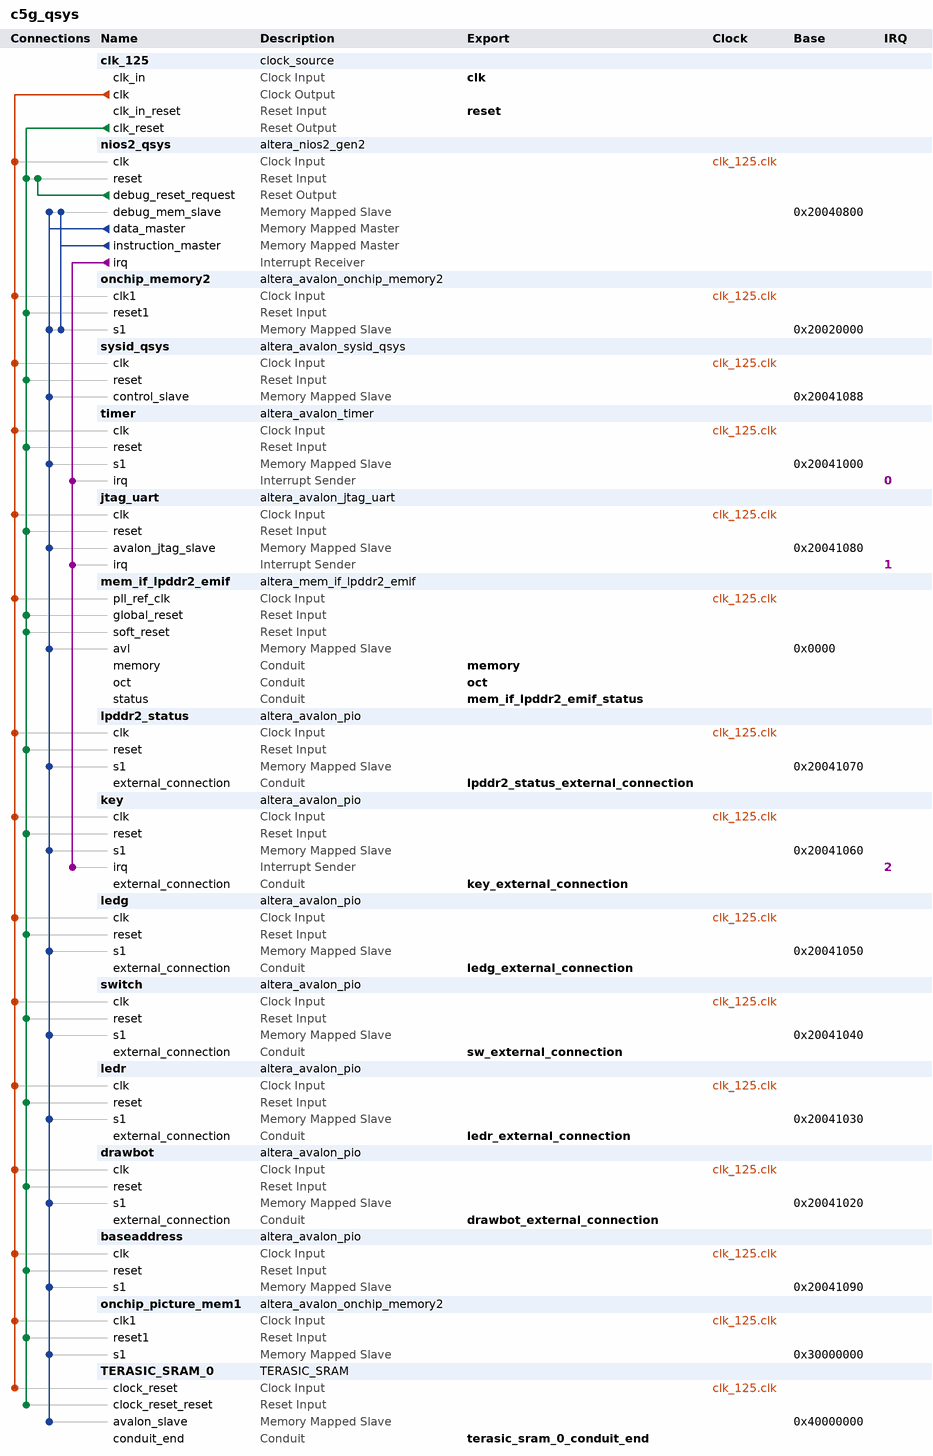
[diagram p0: system contents]
# Platform Designer (Qsys) system c5g_qsys, Cyclone V 5CGXFC5C6F27C7
# Parameters at their usual value, and those the tool derives, are not listed.
package require -exact qsys 15.1
create_system c5g_qsys
set_project_property DEVICE_FAMILY {Cyclone V}
set_project_property DEVICE 5CGXFC5C6F27C7

add_instance clk_125 clock_source 15.1
set_instance_parameter_value clk_125 clockFrequency 125000000

add_instance nios2_qsys altera_nios2_gen2 15.1
set_instance_parameter_value nios2_qsys dcache_size 2048
set_instance_parameter_value nios2_qsys exceptionSlave onchip_memory2.s1
set_instance_parameter_value nios2_qsys icache_size 4096
set_instance_parameter_value nios2_qsys impl Fast
set_instance_parameter_value nios2_qsys resetSlave onchip_memory2.s1
set_instance_parameter_value nios2_qsys setting_activateTrace true

add_instance onchip_memory2 altera_avalon_onchip_memory2 15.1
set_instance_parameter_value onchip_memory2 dataWidth 32
set_instance_parameter_value onchip_memory2 dualPort false
set_instance_parameter_value onchip_memory2 initMemContent true
set_instance_parameter_value onchip_memory2 initializationFileName onchip_mem.hex
set_instance_parameter_value onchip_memory2 memorySize 128000

add_instance sysid_qsys altera_avalon_sysid_qsys 15.1
set_instance_parameter_value sysid_qsys id -1091581186

add_instance timer altera_avalon_timer 15.1
set_instance_parameter_value timer period 1
set_instance_parameter_value timer periodUnits USEC

add_instance jtag_uart altera_avalon_jtag_uart 15.1
set_instance_parameter_value jtag_uart simInteractiveOptions NO_INTERACTIVE_WINDOWS

add_instance mem_if_lpddr2_emif altera_mem_if_lpddr2_emif 15.1
set_instance_parameter_value mem_if_lpddr2_emif ABSTRACT_REAL_COMPARE_TEST false
set_instance_parameter_value mem_if_lpddr2_emif ABS_RAM_MEM_INIT_FILENAME meminit
set_instance_parameter_value mem_if_lpddr2_emif ACV_PHY_CLK_ADD_FR_PHASE 0.0
set_instance_parameter_value mem_if_lpddr2_emif AC_PACKAGE_DESKEW false
set_instance_parameter_value mem_if_lpddr2_emif AC_ROM_USER_ADD_0 0_0000_0000_0000
set_instance_parameter_value mem_if_lpddr2_emif AC_ROM_USER_ADD_1 0_0000_0000_1000
set_instance_parameter_value mem_if_lpddr2_emif ADDR_ORDER 0
set_instance_parameter_value mem_if_lpddr2_emif ADD_EFFICIENCY_MONITOR false
set_instance_parameter_value mem_if_lpddr2_emif ADD_EXTERNAL_SEQ_DEBUG_NIOS false
set_instance_parameter_value mem_if_lpddr2_emif ADVANCED_CK_PHASES false
set_instance_parameter_value mem_if_lpddr2_emif ADVERTIZE_SEQUENCER_SW_BUILD_FILES false
set_instance_parameter_value mem_if_lpddr2_emif AFI_DEBUG_INFO_WIDTH 32
set_instance_parameter_value mem_if_lpddr2_emif ALTMEMPHY_COMPATIBLE_MODE false
set_instance_parameter_value mem_if_lpddr2_emif AP_MODE false
set_instance_parameter_value mem_if_lpddr2_emif AP_MODE_EN 0
set_instance_parameter_value mem_if_lpddr2_emif AVL_DATA_WIDTH_PORT 32,32,32,32,32,32
set_instance_parameter_value mem_if_lpddr2_emif AVL_MAX_SIZE 4
set_instance_parameter_value mem_if_lpddr2_emif BYTE_ENABLE true
set_instance_parameter_value mem_if_lpddr2_emif C2P_WRITE_CLOCK_ADD_PHASE 0.0
set_instance_parameter_value mem_if_lpddr2_emif CALIBRATION_MODE Skip
set_instance_parameter_value mem_if_lpddr2_emif CALIB_REG_WIDTH 8
set_instance_parameter_value mem_if_lpddr2_emif CFG_DATA_REORDERING_TYPE INTER_BANK
set_instance_parameter_value mem_if_lpddr2_emif CFG_REORDER_DATA true
set_instance_parameter_value mem_if_lpddr2_emif CFG_TCCD_NS 2.5
set_instance_parameter_value mem_if_lpddr2_emif COMMAND_PHASE 0.0
set_instance_parameter_value mem_if_lpddr2_emif CONTROLLER_LATENCY 5
set_instance_parameter_value mem_if_lpddr2_emif CORE_DEBUG_CONNECTION EXPORT
set_instance_parameter_value mem_if_lpddr2_emif CPORT_TYPE_PORT Bidirectional,Bidirectional,Bidirectional,Bidirectional,Bidirectional,Bidirectional
set_instance_parameter_value mem_if_lpddr2_emif CTL_AUTOPCH_EN false
set_instance_parameter_value mem_if_lpddr2_emif CTL_CMD_QUEUE_DEPTH 8
set_instance_parameter_value mem_if_lpddr2_emif CTL_CSR_CONNECTION INTERNAL_JTAG
set_instance_parameter_value mem_if_lpddr2_emif CTL_CSR_ENABLED false
set_instance_parameter_value mem_if_lpddr2_emif CTL_CSR_READ_ONLY 1
set_instance_parameter_value mem_if_lpddr2_emif CTL_DEEP_POWERDN_EN false
set_instance_parameter_value mem_if_lpddr2_emif CTL_DYNAMIC_BANK_ALLOCATION false
set_instance_parameter_value mem_if_lpddr2_emif CTL_DYNAMIC_BANK_NUM 4
set_instance_parameter_value mem_if_lpddr2_emif CTL_ECC_AUTO_CORRECTION_ENABLED false
set_instance_parameter_value mem_if_lpddr2_emif CTL_ECC_ENABLED false
set_instance_parameter_value mem_if_lpddr2_emif CTL_ENABLE_BURST_INTERRUPT false
set_instance_parameter_value mem_if_lpddr2_emif CTL_ENABLE_BURST_TERMINATE false
set_instance_parameter_value mem_if_lpddr2_emif CTL_HRB_ENABLED false
set_instance_parameter_value mem_if_lpddr2_emif CTL_LOOK_AHEAD_DEPTH 4
set_instance_parameter_value mem_if_lpddr2_emif CTL_SELF_REFRESH_EN false
set_instance_parameter_value mem_if_lpddr2_emif CTL_USR_REFRESH_EN false
set_instance_parameter_value mem_if_lpddr2_emif CTL_ZQCAL_EN false
set_instance_parameter_value mem_if_lpddr2_emif CUT_NEW_FAMILY_TIMING true
set_instance_parameter_value mem_if_lpddr2_emif DAT_DATA_WIDTH 32
set_instance_parameter_value mem_if_lpddr2_emif DEBUG_MODE false
set_instance_parameter_value mem_if_lpddr2_emif DEVICE_DEPTH 1
set_instance_parameter_value mem_if_lpddr2_emif DISABLE_CHILD_MESSAGING false
set_instance_parameter_value mem_if_lpddr2_emif DISCRETE_FLY_BY true
set_instance_parameter_value mem_if_lpddr2_emif DLL_SHARING_MODE None
set_instance_parameter_value mem_if_lpddr2_emif DQS_DQSN_MODE DIFFERENTIAL
set_instance_parameter_value mem_if_lpddr2_emif DQ_INPUT_REG_USE_CLKN false
set_instance_parameter_value mem_if_lpddr2_emif DUPLICATE_AC false
set_instance_parameter_value mem_if_lpddr2_emif ED_EXPORT_SEQ_DEBUG false
set_instance_parameter_value mem_if_lpddr2_emif ENABLE_ABS_RAM_MEM_INIT false
set_instance_parameter_value mem_if_lpddr2_emif ENABLE_BONDING false
set_instance_parameter_value mem_if_lpddr2_emif ENABLE_BURST_MERGE false
set_instance_parameter_value mem_if_lpddr2_emif ENABLE_CTRL_AVALON_INTERFACE true
set_instance_parameter_value mem_if_lpddr2_emif ENABLE_DELAY_CHAIN_WRITE false
set_instance_parameter_value mem_if_lpddr2_emif ENABLE_EMIT_BFM_MASTER false
set_instance_parameter_value mem_if_lpddr2_emif ENABLE_EXPORT_SEQ_DEBUG_BRIDGE false
set_instance_parameter_value mem_if_lpddr2_emif ENABLE_EXTRA_REPORTING false
set_instance_parameter_value mem_if_lpddr2_emif ENABLE_ISS_PROBES false
set_instance_parameter_value mem_if_lpddr2_emif ENABLE_NON_DESTRUCTIVE_CALIB false
set_instance_parameter_value mem_if_lpddr2_emif ENABLE_NON_DES_CAL false
set_instance_parameter_value mem_if_lpddr2_emif ENABLE_NON_DES_CAL_TEST false
set_instance_parameter_value mem_if_lpddr2_emif ENABLE_SEQUENCER_MARGINING_ON_BY_DEFAULT false
set_instance_parameter_value mem_if_lpddr2_emif ENABLE_USER_ECC false
set_instance_parameter_value mem_if_lpddr2_emif EXPORT_AFI_HALF_CLK false
set_instance_parameter_value mem_if_lpddr2_emif FORCED_NON_LDC_ADDR_CMD_MEM_CK_INVERT false
set_instance_parameter_value mem_if_lpddr2_emif FORCED_NUM_WRITE_FR_CYCLE_SHIFTS 0
set_instance_parameter_value mem_if_lpddr2_emif FORCE_DQS_TRACKING AUTO
set_instance_parameter_value mem_if_lpddr2_emif FORCE_MAX_LATENCY_COUNT_WIDTH 0
set_instance_parameter_value mem_if_lpddr2_emif FORCE_SEQUENCER_TCL_DEBUG_MODE false
set_instance_parameter_value mem_if_lpddr2_emif FORCE_SHADOW_REGS AUTO
set_instance_parameter_value mem_if_lpddr2_emif HARD_EMIF false
set_instance_parameter_value mem_if_lpddr2_emif HCX_COMPAT_MODE false
set_instance_parameter_value mem_if_lpddr2_emif HHP_HPS false
set_instance_parameter_value mem_if_lpddr2_emif HHP_HPS_SIMULATION false
set_instance_parameter_value mem_if_lpddr2_emif HHP_HPS_VERIFICATION false
set_instance_parameter_value mem_if_lpddr2_emif HPS_PROTOCOL DEFAULT
set_instance_parameter_value mem_if_lpddr2_emif INCLUDE_BOARD_DELAY_MODEL false
set_instance_parameter_value mem_if_lpddr2_emif INCLUDE_MULTIRANK_BOARD_DELAY_MODEL false
set_instance_parameter_value mem_if_lpddr2_emif IS_ES_DEVICE false
set_instance_parameter_value mem_if_lpddr2_emif LOCAL_ID_WIDTH 8
set_instance_parameter_value mem_if_lpddr2_emif MARGIN_VARIATION_TEST false
set_instance_parameter_value mem_if_lpddr2_emif MAX_PENDING_RD_CMD 16
set_instance_parameter_value mem_if_lpddr2_emif MAX_PENDING_WR_CMD 8
set_instance_parameter_value mem_if_lpddr2_emif MEM_ATCL 0
set_instance_parameter_value mem_if_lpddr2_emif MEM_AUTO_LEVELING_MODE true
set_instance_parameter_value mem_if_lpddr2_emif MEM_BANKADDR_WIDTH 3
set_instance_parameter_value mem_if_lpddr2_emif MEM_BL 8
set_instance_parameter_value mem_if_lpddr2_emif MEM_BT Sequential
set_instance_parameter_value mem_if_lpddr2_emif MEM_CK_PHASE 0.0
set_instance_parameter_value mem_if_lpddr2_emif MEM_CK_WIDTH 1
set_instance_parameter_value mem_if_lpddr2_emif MEM_CLK_EN_WIDTH 1
set_instance_parameter_value mem_if_lpddr2_emif MEM_CLK_FREQ 250.0
set_instance_parameter_value mem_if_lpddr2_emif MEM_CLK_FREQ_MAX 400.0
set_instance_parameter_value mem_if_lpddr2_emif MEM_COL_ADDR_WIDTH 10
set_instance_parameter_value mem_if_lpddr2_emif MEM_CS_WIDTH 1
set_instance_parameter_value mem_if_lpddr2_emif MEM_DEVICE MISSING_MODEL
set_instance_parameter_value mem_if_lpddr2_emif MEM_DLL_EN true
set_instance_parameter_value mem_if_lpddr2_emif MEM_DQ_PER_DQS 8
set_instance_parameter_value mem_if_lpddr2_emif MEM_DQ_WIDTH 32
set_instance_parameter_value mem_if_lpddr2_emif MEM_DRV_STR 40
set_instance_parameter_value mem_if_lpddr2_emif MEM_FORMAT DISCRETE
set_instance_parameter_value mem_if_lpddr2_emif MEM_GUARANTEED_WRITE_INIT false
set_instance_parameter_value mem_if_lpddr2_emif MEM_IF_BOARD_BASE_DELAY 10
set_instance_parameter_value mem_if_lpddr2_emif MEM_IF_DM_PINS_EN true
set_instance_parameter_value mem_if_lpddr2_emif MEM_IF_DQSN_EN true
set_instance_parameter_value mem_if_lpddr2_emif MEM_IF_SIM_VALID_WINDOW 0
set_instance_parameter_value mem_if_lpddr2_emif MEM_INIT_EN false
set_instance_parameter_value mem_if_lpddr2_emif MEM_MIRROR_ADDRESSING 0
set_instance_parameter_value mem_if_lpddr2_emif MEM_NUMBER_OF_DIMMS 1
set_instance_parameter_value mem_if_lpddr2_emif MEM_NUMBER_OF_RANKS_PER_DEVICE 1
set_instance_parameter_value mem_if_lpddr2_emif MEM_NUMBER_OF_RANKS_PER_DIMM 1
set_instance_parameter_value mem_if_lpddr2_emif MEM_RANK_MULTIPLICATION_FACTOR 1
set_instance_parameter_value mem_if_lpddr2_emif MEM_ROW_ADDR_WIDTH 14
set_instance_parameter_value mem_if_lpddr2_emif MEM_TCL 7
set_instance_parameter_value mem_if_lpddr2_emif MEM_TFAW_NS 50.0
set_instance_parameter_value mem_if_lpddr2_emif MEM_TINIT_US 200
set_instance_parameter_value mem_if_lpddr2_emif MEM_TMRD_CK 2
set_instance_parameter_value mem_if_lpddr2_emif MEM_TRAS_NS 70.0
set_instance_parameter_value mem_if_lpddr2_emif MEM_TRCD_NS 18.0
set_instance_parameter_value mem_if_lpddr2_emif MEM_TREFI_US 3.9
set_instance_parameter_value mem_if_lpddr2_emif MEM_TRFC_NS 60.0
set_instance_parameter_value mem_if_lpddr2_emif MEM_TRP_NS 18.0
set_instance_parameter_value mem_if_lpddr2_emif MEM_TRRD_NS 10.0
set_instance_parameter_value mem_if_lpddr2_emif MEM_TRTP_NS 7.5
set_instance_parameter_value mem_if_lpddr2_emif MEM_TWR_NS 15.0
set_instance_parameter_value mem_if_lpddr2_emif MEM_TWTR 2
set_instance_parameter_value mem_if_lpddr2_emif MEM_USER_LEVELING_MODE Leveling
set_instance_parameter_value mem_if_lpddr2_emif MEM_VENDOR Micron
set_instance_parameter_value mem_if_lpddr2_emif MEM_VERBOSE true
set_instance_parameter_value mem_if_lpddr2_emif MRS_MIRROR_PING_PONG_ATSO false
set_instance_parameter_value mem_if_lpddr2_emif MULTICAST_EN false
set_instance_parameter_value mem_if_lpddr2_emif NEXTGEN true
set_instance_parameter_value mem_if_lpddr2_emif NIOS_ROM_DATA_WIDTH 32
set_instance_parameter_value mem_if_lpddr2_emif NUM_DLL_SHARING_INTERFACES 1
set_instance_parameter_value mem_if_lpddr2_emif NUM_EXTRA_REPORT_PATH 10
set_instance_parameter_value mem_if_lpddr2_emif NUM_OCT_SHARING_INTERFACES 1
set_instance_parameter_value mem_if_lpddr2_emif NUM_OF_PORTS 1
set_instance_parameter_value mem_if_lpddr2_emif NUM_PLL_SHARING_INTERFACES 1
set_instance_parameter_value mem_if_lpddr2_emif OCT_SHARING_MODE None
set_instance_parameter_value mem_if_lpddr2_emif P2C_READ_CLOCK_ADD_PHASE 0.0
set_instance_parameter_value mem_if_lpddr2_emif PACKAGE_DESKEW false
set_instance_parameter_value mem_if_lpddr2_emif PARSE_FRIENDLY_DEVICE_FAMILY_PARAM_VALID false
set_instance_parameter_value mem_if_lpddr2_emif PHY_CSR_CONNECTION INTERNAL_JTAG
set_instance_parameter_value mem_if_lpddr2_emif PHY_CSR_ENABLED false
set_instance_parameter_value mem_if_lpddr2_emif PHY_ONLY false
set_instance_parameter_value mem_if_lpddr2_emif PINGPONGPHY_EN false
set_instance_parameter_value mem_if_lpddr2_emif PLL_ADDR_CMD_CLK_DIV_PARAM 0
set_instance_parameter_value mem_if_lpddr2_emif PLL_ADDR_CMD_CLK_FREQ_PARAM 0.0
set_instance_parameter_value mem_if_lpddr2_emif PLL_ADDR_CMD_CLK_MULT_PARAM 0
set_instance_parameter_value mem_if_lpddr2_emif PLL_ADDR_CMD_CLK_PHASE_PS_PARAM 0
set_instance_parameter_value mem_if_lpddr2_emif PLL_AFI_CLK_DIV_PARAM 0
set_instance_parameter_value mem_if_lpddr2_emif PLL_AFI_CLK_FREQ_PARAM 0.0
set_instance_parameter_value mem_if_lpddr2_emif PLL_AFI_CLK_MULT_PARAM 0
set_instance_parameter_value mem_if_lpddr2_emif PLL_AFI_CLK_PHASE_PS_PARAM 0
set_instance_parameter_value mem_if_lpddr2_emif PLL_AFI_HALF_CLK_DIV_PARAM 0
set_instance_parameter_value mem_if_lpddr2_emif PLL_AFI_HALF_CLK_FREQ_PARAM 0.0
set_instance_parameter_value mem_if_lpddr2_emif PLL_AFI_HALF_CLK_MULT_PARAM 0
set_instance_parameter_value mem_if_lpddr2_emif PLL_AFI_HALF_CLK_PHASE_PS_PARAM 0
set_instance_parameter_value mem_if_lpddr2_emif PLL_AFI_PHY_CLK_DIV_PARAM 0
set_instance_parameter_value mem_if_lpddr2_emif PLL_AFI_PHY_CLK_FREQ_PARAM 0.0
set_instance_parameter_value mem_if_lpddr2_emif PLL_AFI_PHY_CLK_MULT_PARAM 0
set_instance_parameter_value mem_if_lpddr2_emif PLL_AFI_PHY_CLK_PHASE_PS_PARAM 0
set_instance_parameter_value mem_if_lpddr2_emif PLL_C2P_WRITE_CLK_DIV_PARAM 0
set_instance_parameter_value mem_if_lpddr2_emif PLL_C2P_WRITE_CLK_FREQ_PARAM 0.0
set_instance_parameter_value mem_if_lpddr2_emif PLL_C2P_WRITE_CLK_MULT_PARAM 0
set_instance_parameter_value mem_if_lpddr2_emif PLL_C2P_WRITE_CLK_PHASE_PS_PARAM 0
set_instance_parameter_value mem_if_lpddr2_emif PLL_CLK_PARAM_VALID false
set_instance_parameter_value mem_if_lpddr2_emif PLL_CONFIG_CLK_DIV_PARAM 0
set_instance_parameter_value mem_if_lpddr2_emif PLL_CONFIG_CLK_FREQ_PARAM 0.0
set_instance_parameter_value mem_if_lpddr2_emif PLL_CONFIG_CLK_MULT_PARAM 0
set_instance_parameter_value mem_if_lpddr2_emif PLL_CONFIG_CLK_PHASE_PS_PARAM 0
set_instance_parameter_value mem_if_lpddr2_emif PLL_DR_CLK_DIV_PARAM 0
set_instance_parameter_value mem_if_lpddr2_emif PLL_DR_CLK_FREQ_PARAM 0.0
set_instance_parameter_value mem_if_lpddr2_emif PLL_DR_CLK_MULT_PARAM 0
set_instance_parameter_value mem_if_lpddr2_emif PLL_DR_CLK_PHASE_PS_PARAM 0
set_instance_parameter_value mem_if_lpddr2_emif PLL_HR_CLK_DIV_PARAM 0
set_instance_parameter_value mem_if_lpddr2_emif PLL_HR_CLK_FREQ_PARAM 0.0
set_instance_parameter_value mem_if_lpddr2_emif PLL_HR_CLK_MULT_PARAM 0
set_instance_parameter_value mem_if_lpddr2_emif PLL_HR_CLK_PHASE_PS_PARAM 0
set_instance_parameter_value mem_if_lpddr2_emif PLL_LOCATION Top_Bottom
set_instance_parameter_value mem_if_lpddr2_emif PLL_MEM_CLK_DIV_PARAM 0
set_instance_parameter_value mem_if_lpddr2_emif PLL_MEM_CLK_FREQ_PARAM 0.0
set_instance_parameter_value mem_if_lpddr2_emif PLL_MEM_CLK_MULT_PARAM 0
set_instance_parameter_value mem_if_lpddr2_emif PLL_MEM_CLK_PHASE_PS_PARAM 0
set_instance_parameter_value mem_if_lpddr2_emif PLL_NIOS_CLK_DIV_PARAM 0
set_instance_parameter_value mem_if_lpddr2_emif PLL_NIOS_CLK_FREQ_PARAM 0.0
set_instance_parameter_value mem_if_lpddr2_emif PLL_NIOS_CLK_MULT_PARAM 0
set_instance_parameter_value mem_if_lpddr2_emif PLL_NIOS_CLK_PHASE_PS_PARAM 0
set_instance_parameter_value mem_if_lpddr2_emif PLL_P2C_READ_CLK_DIV_PARAM 0
set_instance_parameter_value mem_if_lpddr2_emif PLL_P2C_READ_CLK_FREQ_PARAM 0.0
set_instance_parameter_value mem_if_lpddr2_emif PLL_P2C_READ_CLK_MULT_PARAM 0
set_instance_parameter_value mem_if_lpddr2_emif PLL_P2C_READ_CLK_PHASE_PS_PARAM 0
set_instance_parameter_value mem_if_lpddr2_emif PLL_SHARING_MODE None
set_instance_parameter_value mem_if_lpddr2_emif PLL_WRITE_CLK_DIV_PARAM 0
set_instance_parameter_value mem_if_lpddr2_emif PLL_WRITE_CLK_FREQ_PARAM 0.0
set_instance_parameter_value mem_if_lpddr2_emif PLL_WRITE_CLK_MULT_PARAM 0
set_instance_parameter_value mem_if_lpddr2_emif PLL_WRITE_CLK_PHASE_PS_PARAM 0
set_instance_parameter_value mem_if_lpddr2_emif POWER_OF_TWO_BUS false
set_instance_parameter_value mem_if_lpddr2_emif PRIORITY_PORT 1,1,1,1,1,1
set_instance_parameter_value mem_if_lpddr2_emif RATE Half
set_instance_parameter_value mem_if_lpddr2_emif READ_DQ_DQS_CLOCK_SOURCE INVERTED_DQS_BUS
set_instance_parameter_value mem_if_lpddr2_emif READ_FIFO_SIZE 8
set_instance_parameter_value mem_if_lpddr2_emif REFRESH_BURST_VALIDATION false
set_instance_parameter_value mem_if_lpddr2_emif REFRESH_INTERVAL 15000
set_instance_parameter_value mem_if_lpddr2_emif REF_CLK_FREQ 125.0
set_instance_parameter_value mem_if_lpddr2_emif REF_CLK_FREQ_MAX_PARAM 0.0
set_instance_parameter_value mem_if_lpddr2_emif REF_CLK_FREQ_MIN_PARAM 0.0
set_instance_parameter_value mem_if_lpddr2_emif REF_CLK_FREQ_PARAM_VALID false
set_instance_parameter_value mem_if_lpddr2_emif SEQUENCER_TYPE NIOS
set_instance_parameter_value mem_if_lpddr2_emif SEQ_MODE 0
set_instance_parameter_value mem_if_lpddr2_emif SKIP_MEM_INIT true
set_instance_parameter_value mem_if_lpddr2_emif SOPC_COMPAT_RESET false
set_instance_parameter_value mem_if_lpddr2_emif SPEED_GRADE 7
set_instance_parameter_value mem_if_lpddr2_emif STARVE_LIMIT 10
set_instance_parameter_value mem_if_lpddr2_emif TIMING_BOARD_AC_EYE_REDUCTION_H 0.0
set_instance_parameter_value mem_if_lpddr2_emif TIMING_BOARD_AC_EYE_REDUCTION_SU 0.0
set_instance_parameter_value mem_if_lpddr2_emif TIMING_BOARD_AC_SKEW 0.02
set_instance_parameter_value mem_if_lpddr2_emif TIMING_BOARD_AC_SLEW_RATE 1.0
set_instance_parameter_value mem_if_lpddr2_emif TIMING_BOARD_AC_TO_CK_SKEW 0.0
set_instance_parameter_value mem_if_lpddr2_emif TIMING_BOARD_CK_CKN_SLEW_RATE 2.0
set_instance_parameter_value mem_if_lpddr2_emif TIMING_BOARD_DELTA_DQS_ARRIVAL_TIME 0.0
set_instance_parameter_value mem_if_lpddr2_emif TIMING_BOARD_DELTA_READ_DQS_ARRIVAL_TIME 0.0
set_instance_parameter_value mem_if_lpddr2_emif TIMING_BOARD_DERATE_METHOD AUTO
set_instance_parameter_value mem_if_lpddr2_emif TIMING_BOARD_DQS_DQSN_SLEW_RATE 2.0
set_instance_parameter_value mem_if_lpddr2_emif TIMING_BOARD_DQ_EYE_REDUCTION 0.0
set_instance_parameter_value mem_if_lpddr2_emif TIMING_BOARD_DQ_SLEW_RATE 1.0
set_instance_parameter_value mem_if_lpddr2_emif TIMING_BOARD_DQ_TO_DQS_SKEW 0.0
set_instance_parameter_value mem_if_lpddr2_emif TIMING_BOARD_ISI_METHOD AUTO
set_instance_parameter_value mem_if_lpddr2_emif TIMING_BOARD_MAX_CK_DELAY 0.33
set_instance_parameter_value mem_if_lpddr2_emif TIMING_BOARD_MAX_DQS_DELAY 0.34
set_instance_parameter_value mem_if_lpddr2_emif TIMING_BOARD_READ_DQ_EYE_REDUCTION 0.0
set_instance_parameter_value mem_if_lpddr2_emif TIMING_BOARD_SKEW_BETWEEN_DIMMS 0.05
set_instance_parameter_value mem_if_lpddr2_emif TIMING_BOARD_SKEW_BETWEEN_DQS 0.02
set_instance_parameter_value mem_if_lpddr2_emif TIMING_BOARD_SKEW_CKDQS_DIMM_MAX 0.01
set_instance_parameter_value mem_if_lpddr2_emif TIMING_BOARD_SKEW_CKDQS_DIMM_MIN -0.01
set_instance_parameter_value mem_if_lpddr2_emif TIMING_BOARD_SKEW_WITHIN_DQS 0.02
set_instance_parameter_value mem_if_lpddr2_emif TIMING_BOARD_TDH 0.0
set_instance_parameter_value mem_if_lpddr2_emif TIMING_BOARD_TDS 0.0
set_instance_parameter_value mem_if_lpddr2_emif TIMING_BOARD_TIH 0.0
set_instance_parameter_value mem_if_lpddr2_emif TIMING_BOARD_TIS 0.0
set_instance_parameter_value mem_if_lpddr2_emif TIMING_TDH 270
set_instance_parameter_value mem_if_lpddr2_emif TIMING_TDQSCK 5500
set_instance_parameter_value mem_if_lpddr2_emif TIMING_TDQSCKDL 1200
set_instance_parameter_value mem_if_lpddr2_emif TIMING_TDQSCKDM 900
set_instance_parameter_value mem_if_lpddr2_emif TIMING_TDQSCKDS 450
set_instance_parameter_value mem_if_lpddr2_emif TIMING_TDQSH 0.4
set_instance_parameter_value mem_if_lpddr2_emif TIMING_TDQSQ 240
set_instance_parameter_value mem_if_lpddr2_emif TIMING_TDQSS 1.0
set_instance_parameter_value mem_if_lpddr2_emif TIMING_TDS 270
set_instance_parameter_value mem_if_lpddr2_emif TIMING_TDSH 0.2
set_instance_parameter_value mem_if_lpddr2_emif TIMING_TDSS 0.2
set_instance_parameter_value mem_if_lpddr2_emif TIMING_TIH 290
set_instance_parameter_value mem_if_lpddr2_emif TIMING_TIS 290
set_instance_parameter_value mem_if_lpddr2_emif TIMING_TQHS 280
set_instance_parameter_value mem_if_lpddr2_emif TRACKING_ERROR_TEST false
set_instance_parameter_value mem_if_lpddr2_emif TRACKING_WATCH_TEST false
set_instance_parameter_value mem_if_lpddr2_emif TREFI 35100
set_instance_parameter_value mem_if_lpddr2_emif TRFC 350
set_instance_parameter_value mem_if_lpddr2_emif USER_DEBUG_LEVEL 0
set_instance_parameter_value mem_if_lpddr2_emif USE_AXI_ADAPTOR false
set_instance_parameter_value mem_if_lpddr2_emif USE_FAKE_PHY false
set_instance_parameter_value mem_if_lpddr2_emif USE_MEM_CLK_FREQ false
set_instance_parameter_value mem_if_lpddr2_emif USE_MM_ADAPTOR true
set_instance_parameter_value mem_if_lpddr2_emif USE_SEQUENCER_BFM false
set_instance_parameter_value mem_if_lpddr2_emif WEIGHT_PORT 0,0,0,0,0,0
set_instance_parameter_value mem_if_lpddr2_emif WRBUFFER_ADDR_WIDTH 6

add_instance lpddr2_status altera_avalon_pio 15.1
set_instance_parameter_value lpddr2_status direction Input
set_instance_parameter_value lpddr2_status width 3

add_instance key altera_avalon_pio 15.1
set_instance_parameter_value key captureEdge true
set_instance_parameter_value key direction Input
set_instance_parameter_value key generateIRQ true
set_instance_parameter_value key irqType EDGE
set_instance_parameter_value key width 4

add_instance ledg altera_avalon_pio 15.1
set_instance_parameter_value ledg direction Output
set_instance_parameter_value ledg width 8

add_instance switch altera_avalon_pio 15.1
set_instance_parameter_value switch captureEdge true
set_instance_parameter_value switch direction Input
set_instance_parameter_value switch width 10

add_instance ledr altera_avalon_pio 15.1
set_instance_parameter_value ledr direction Output
set_instance_parameter_value ledr width 10

add_instance drawbot altera_avalon_pio 15.1
set_instance_parameter_value drawbot direction Output
set_instance_parameter_value drawbot width 7

add_instance baseaddress altera_avalon_pio 15.1
set_instance_parameter_value baseaddress direction Output
set_instance_parameter_value baseaddress width 32

add_instance onchip_picture_mem1 altera_avalon_onchip_memory2 15.1
set_instance_parameter_value onchip_picture_mem1 dataWidth 8
set_instance_parameter_value onchip_picture_mem1 dualPort false
set_instance_parameter_value onchip_picture_mem1 initMemContent false
set_instance_parameter_value onchip_picture_mem1 initializationFileName onchip_mem.hex
set_instance_parameter_value onchip_picture_mem1 memorySize 262144
set_instance_parameter_value onchip_picture_mem1 slave1Latency 2

add_instance TERASIC_SRAM_0 TERASIC_SRAM 1.0
set_instance_parameter_value TERASIC_SRAM_0 ADDR_BITS 20
set_instance_parameter_value TERASIC_SRAM_0 DATA_BITS 16

# connections
add_connection clk_125.clk baseaddress.clk clock
add_connection clk_125.clk drawbot.clk clock
add_connection clk_125.clk jtag_uart.clk clock
add_connection clk_125.clk key.clk clock
add_connection clk_125.clk ledg.clk clock
add_connection clk_125.clk ledr.clk clock
add_connection clk_125.clk lpddr2_status.clk clock
add_connection clk_125.clk mem_if_lpddr2_emif.pll_ref_clk clock
add_connection clk_125.clk nios2_qsys.clk clock
add_connection clk_125.clk onchip_memory2.clk1 clock
add_connection clk_125.clk onchip_picture_mem1.clk1 clock
add_connection clk_125.clk switch.clk clock
add_connection clk_125.clk sysid_qsys.clk clock
add_connection clk_125.clk TERASIC_SRAM_0.clock_reset clock
add_connection clk_125.clk timer.clk clock
add_connection clk_125.clk_reset baseaddress.reset reset
add_connection clk_125.clk_reset drawbot.reset reset
add_connection clk_125.clk_reset jtag_uart.reset reset
add_connection clk_125.clk_reset key.reset reset
add_connection clk_125.clk_reset ledg.reset reset
add_connection clk_125.clk_reset ledr.reset reset
add_connection clk_125.clk_reset lpddr2_status.reset reset
add_connection clk_125.clk_reset mem_if_lpddr2_emif.global_reset reset
add_connection clk_125.clk_reset mem_if_lpddr2_emif.soft_reset reset
add_connection clk_125.clk_reset nios2_qsys.reset reset
add_connection clk_125.clk_reset onchip_memory2.reset1 reset
add_connection clk_125.clk_reset onchip_picture_mem1.reset1 reset
add_connection clk_125.clk_reset switch.reset reset
add_connection clk_125.clk_reset sysid_qsys.reset reset
add_connection clk_125.clk_reset TERASIC_SRAM_0.clock_reset_reset reset
add_connection clk_125.clk_reset timer.reset reset
add_connection nios2_qsys.debug_reset_request nios2_qsys.reset reset
add_connection nios2_qsys.data_master baseaddress.s1 avalon
set_connection_parameter_value nios2_qsys.data_master/baseaddress.s1 baseAddress 0x20041090
add_connection nios2_qsys.data_master drawbot.s1 avalon
set_connection_parameter_value nios2_qsys.data_master/drawbot.s1 baseAddress 0x20041020
add_connection nios2_qsys.data_master jtag_uart.avalon_jtag_slave avalon
set_connection_parameter_value nios2_qsys.data_master/jtag_uart.avalon_jtag_slave baseAddress 0x20041080
add_connection nios2_qsys.data_master key.s1 avalon
set_connection_parameter_value nios2_qsys.data_master/key.s1 baseAddress 0x20041060
add_connection nios2_qsys.data_master ledg.s1 avalon
set_connection_parameter_value nios2_qsys.data_master/ledg.s1 baseAddress 0x20041050
add_connection nios2_qsys.data_master ledr.s1 avalon
set_connection_parameter_value nios2_qsys.data_master/ledr.s1 baseAddress 0x20041030
add_connection nios2_qsys.data_master lpddr2_status.s1 avalon
set_connection_parameter_value nios2_qsys.data_master/lpddr2_status.s1 baseAddress 0x20041070
add_connection nios2_qsys.data_master mem_if_lpddr2_emif.avl avalon
set_connection_parameter_value nios2_qsys.data_master/mem_if_lpddr2_emif.avl baseAddress 0x0000
add_connection nios2_qsys.data_master nios2_qsys.debug_mem_slave avalon
set_connection_parameter_value nios2_qsys.data_master/nios2_qsys.debug_mem_slave baseAddress 0x20040800
add_connection nios2_qsys.data_master onchip_memory2.s1 avalon
set_connection_parameter_value nios2_qsys.data_master/onchip_memory2.s1 baseAddress 0x20020000
add_connection nios2_qsys.data_master onchip_picture_mem1.s1 avalon
set_connection_parameter_value nios2_qsys.data_master/onchip_picture_mem1.s1 baseAddress 0x30000000
add_connection nios2_qsys.data_master switch.s1 avalon
set_connection_parameter_value nios2_qsys.data_master/switch.s1 baseAddress 0x20041040
add_connection nios2_qsys.data_master sysid_qsys.control_slave avalon
set_connection_parameter_value nios2_qsys.data_master/sysid_qsys.control_slave baseAddress 0x20041088
add_connection nios2_qsys.data_master TERASIC_SRAM_0.avalon_slave avalon
set_connection_parameter_value nios2_qsys.data_master/TERASIC_SRAM_0.avalon_slave baseAddress 0x40000000
add_connection nios2_qsys.data_master timer.s1 avalon
set_connection_parameter_value nios2_qsys.data_master/timer.s1 baseAddress 0x20041000
add_connection nios2_qsys.instruction_master nios2_qsys.debug_mem_slave avalon
set_connection_parameter_value nios2_qsys.instruction_master/nios2_qsys.debug_mem_slave baseAddress 0x20040800
add_connection nios2_qsys.instruction_master onchip_memory2.s1 avalon
set_connection_parameter_value nios2_qsys.instruction_master/onchip_memory2.s1 baseAddress 0x20020000
add_connection nios2_qsys.irq jtag_uart.irq interrupt
set_connection_parameter_value nios2_qsys.irq/jtag_uart.irq irqNumber 1
add_connection nios2_qsys.irq key.irq interrupt
set_connection_parameter_value nios2_qsys.irq/key.irq irqNumber 2
add_connection nios2_qsys.irq timer.irq interrupt
set_connection_parameter_value nios2_qsys.irq/timer.irq irqNumber 0

# exported interfaces
add_interface clk clock sink
set_interface_property clk EXPORT_OF clk_125.clk_in
add_interface drawbot_external_connection conduit end
set_interface_property drawbot_external_connection EXPORT_OF drawbot.external_connection
add_interface key_external_connection conduit end
set_interface_property key_external_connection EXPORT_OF key.external_connection
add_interface ledg_external_connection conduit end
set_interface_property ledg_external_connection EXPORT_OF ledg.external_connection
add_interface ledr_external_connection conduit end
set_interface_property ledr_external_connection EXPORT_OF ledr.external_connection
add_interface lpddr2_status_external_connection conduit end
set_interface_property lpddr2_status_external_connection EXPORT_OF lpddr2_status.external_connection
add_interface mem_if_lpddr2_emif_status conduit end
set_interface_property mem_if_lpddr2_emif_status EXPORT_OF mem_if_lpddr2_emif.status
add_interface memory conduit end
set_interface_property memory EXPORT_OF mem_if_lpddr2_emif.memory
add_interface oct conduit end
set_interface_property oct EXPORT_OF mem_if_lpddr2_emif.oct
add_interface reset reset sink
set_interface_property reset EXPORT_OF clk_125.clk_in_reset
add_interface sw_external_connection conduit end
set_interface_property sw_external_connection EXPORT_OF switch.external_connection
add_interface terasic_sram_0_conduit_end conduit end
set_interface_property terasic_sram_0_conduit_end EXPORT_OF TERASIC_SRAM_0.conduit_end

set_interconnect_requirement {$system} qsys_mm.clockCrossingAdapter HANDSHAKE
set_interconnect_requirement {$system} qsys_mm.maxAdditionalLatency 2

save_system c5g_qsys.qsys
